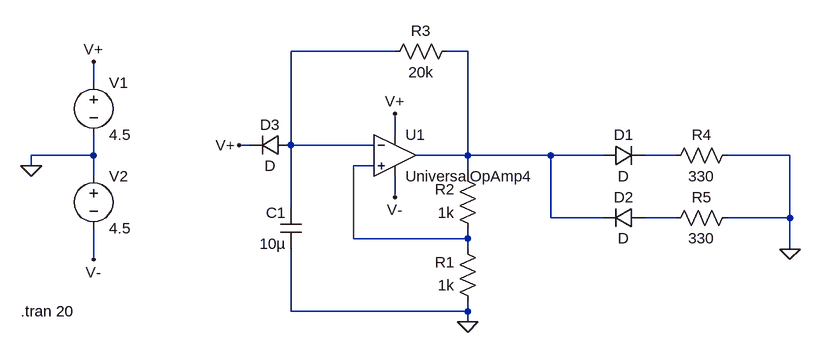
[diagram p0: schematic Oscillating LEDs.asc]
Oscillating LEDs.asc, the LTspice schematic file:
Version 4.1
SHEET 1 884 680
WIRE 256 -64 96 -64
WIRE 368 -64 336 -64
WIRE -208 -16 -208 -48
WIRE 256 64 256 32
WIRE 32 80 16 80
WIRE 96 80 96 -64
WIRE 224 80 96 80
WIRE -208 96 -208 64
WIRE -208 96 -304 96
WIRE 368 96 368 -64
WIRE 368 96 288 96
WIRE 496 96 368 96
WIRE 576 96 496 96
WIRE 688 96 640 96
WIRE 864 96 768 96
WIRE -304 112 -304 96
WIRE 224 112 192 112
WIRE -208 128 -208 96
WIRE 368 128 368 96
WIRE 256 160 256 128
WIRE 96 176 96 80
WIRE 496 192 496 96
WIRE 576 192 496 192
WIRE 688 192 640 192
WIRE 864 192 864 96
WIRE 864 192 768 192
WIRE 192 224 192 112
WIRE 368 224 368 208
WIRE 368 224 192 224
WIRE 368 240 368 224
WIRE 864 240 864 192
WIRE -208 256 -208 208
WIRE 96 336 96 240
WIRE 368 336 368 320
WIRE 368 336 96 336
WIRE 368 352 368 336
FLAG 368 352 0
FLAG 256 32 V+
FLAG 256 160 V-
FLAG -304 112 0
FLAG -208 -48 V+
FLAG -208 256 V-
FLAG 864 240 0
FLAG 16 80 V+
SYMBOL OpAmps\\UniversalOpAmp4 256 96 R0
SYMATTR InstName U1
SYMBOL res 384 336 R180
WINDOW 0 36 76 Left 2
WINDOW 3 36 40 Left 2
SYMATTR InstName R1
SYMATTR Value 1k
SYMBOL res 384 224 R180
WINDOW 0 36 76 Left 2
WINDOW 3 36 40 Left 2
SYMATTR InstName R2
SYMATTR Value 1k
SYMBOL res 352 -80 R90
WINDOW 0 0 56 VBottom 2
WINDOW 3 32 56 VTop 2
SYMATTR InstName R3
SYMATTR Value 20k
SYMBOL cap 112 240 R180
WINDOW 0 24 56 Left 2
WINDOW 3 24 8 Left 2
SYMATTR InstName C1
SYMATTR Value 10µ
SYMBOL diode 576 112 R270
WINDOW 0 32 32 VTop 2
WINDOW 3 0 32 VBottom 2
SYMATTR InstName D1
SYMBOL diode 640 176 R90
WINDOW 0 0 32 VBottom 2
WINDOW 3 32 32 VTop 2
SYMATTR InstName D2
SYMBOL voltage -208 -32 R0
WINDOW 123 0 0 Left 0
WINDOW 39 0 0 Left 0
SYMATTR InstName V1
SYMATTR Value 4.5
SYMBOL voltage -208 112 R0
WINDOW 123 0 0 Left 0
WINDOW 39 0 0 Left 0
SYMATTR InstName V2
SYMATTR Value 4.5
SYMBOL res 784 80 R90
WINDOW 0 0 56 VBottom 2
WINDOW 3 32 56 VTop 2
SYMATTR InstName R4
SYMATTR Value 330
SYMBOL res 784 176 R90
WINDOW 0 0 56 VBottom 2
WINDOW 3 32 56 VTop 2
SYMATTR InstName R5
SYMATTR Value 330
SYMBOL diode 96 64 R90
WINDOW 0 0 32 VBottom 2
WINDOW 3 32 32 VTop 2
SYMATTR InstName D3
TEXT -320 336 Left 2 !.tran 20

The netlist it stands for:
* Oscillating LEDs.asc
* U1: UniversalOpAmp4 (symbol OpAmps\UniversalOpAmp4 not available, pins judged from their places): In+=N004 In-=N001 V+=V+ V-=V- OUT=N002
R1 0 N004 1k
R2 N004 N002 1k
R3 N002 N001 20k
C1 0 N001 10µ
D1 N002 N003 D
D2 N005 N002 D
V1 V+ 0 4.5
V2 0 V- 4.5
R4 0 N003 330
R5 0 N005 330
D3 N001 V+ D
.model D D
.lib standard.dio
.tran 20
.backanno
.end